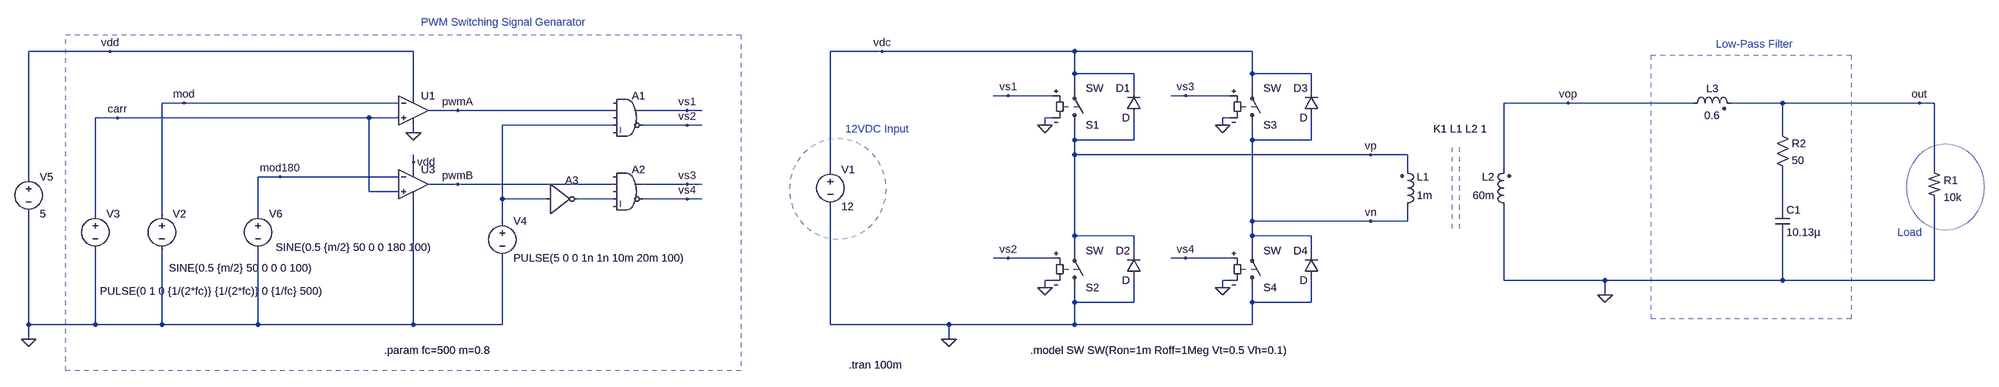
[diagram p0: schematic single-phase-inverter_v2p1.asc]
single-phase-inverter_v2p1.asc, the LTspice schematic file:
Version 4
SHEET 1 2560 1408
WIRE -1952 96 -2128 96
WIRE -1296 96 -1952 96
WIRE -224 96 -336 96
WIRE 192 96 -224 96
WIRE 576 96 192 96
WIRE 192 144 192 96
WIRE 320 144 192 144
WIRE 576 144 576 96
WIRE 704 144 576 144
WIRE 192 176 192 144
WIRE 320 176 320 144
WIRE 576 176 576 144
WIRE 704 176 704 144
WIRE -1296 192 -1296 96
WIRE 48 192 16 192
WIRE 144 192 48 192
WIRE 432 192 400 192
WIRE 528 192 432 192
WIRE -1792 208 -1840 208
WIRE -1328 208 -1792 208
WIRE 1264 208 1120 208
WIRE 1536 208 1264 208
WIRE 1728 208 1616 208
WIRE 2064 208 1728 208
WIRE 2096 208 2064 208
WIRE -1200 224 -1264 224
WIRE -864 224 -1200 224
WIRE -704 224 -800 224
WIRE -672 224 -704 224
WIRE -1936 240 -1984 240
WIRE -1392 240 -1936 240
WIRE -1328 240 -1392 240
WIRE 144 240 128 240
WIRE 528 240 512 240
WIRE -864 256 -1104 256
WIRE -704 256 -800 256
WIRE -672 256 -704 256
WIRE 128 256 128 240
WIRE 512 256 512 240
WIRE -1296 272 -1296 256
WIRE 1728 272 1728 208
WIRE 192 288 192 256
WIRE 320 288 320 240
WIRE 320 288 192 288
WIRE 576 288 576 256
WIRE 704 288 704 240
WIRE 704 288 576 288
WIRE 192 320 192 288
WIRE 832 320 192 320
WIRE 912 320 832 320
WIRE -1296 336 -1296 320
WIRE -1296 352 -1296 336
WIRE -336 352 -336 96
WIRE 912 352 912 320
WIRE 1120 352 1120 208
WIRE 2096 352 2096 208
WIRE -2128 368 -2128 96
WIRE -1584 368 -1632 368
WIRE -1328 368 -1584 368
WIRE -1200 384 -1264 384
WIRE -864 384 -1200 384
WIRE -704 384 -800 384
WIRE -672 384 -704 384
WIRE -1392 400 -1392 240
WIRE -1328 400 -1392 400
WIRE -1104 416 -1104 256
WIRE -1008 416 -1104 416
WIRE -864 416 -944 416
WIRE -704 416 -800 416
WIRE -672 416 -704 416
WIRE 1728 432 1728 352
WIRE -1984 448 -1984 240
WIRE -1840 448 -1840 208
WIRE -1632 448 -1632 368
WIRE -1104 464 -1104 416
WIRE 576 464 576 288
WIRE 832 464 576 464
WIRE 912 464 912 432
WIRE 912 464 832 464
WIRE 192 496 192 320
WIRE 320 496 192 496
WIRE 576 496 576 464
WIRE 704 496 576 496
WIRE 192 528 192 496
WIRE 320 528 320 496
WIRE 576 528 576 496
WIRE 704 528 704 496
WIRE 48 544 16 544
WIRE 144 544 48 544
WIRE 432 544 400 544
WIRE 528 544 432 544
WIRE 144 592 128 592
WIRE 528 592 512 592
WIRE 1120 592 1120 432
WIRE 1344 592 1120 592
WIRE 1728 592 1728 496
WIRE 1728 592 1344 592
WIRE 2096 592 2096 416
WIRE 2096 592 1728 592
WIRE 128 608 128 592
WIRE 512 608 512 592
WIRE 1344 624 1344 592
WIRE 192 640 192 608
WIRE 320 640 320 592
WIRE 320 640 192 640
WIRE 576 640 576 608
WIRE 704 640 704 592
WIRE 704 640 576 640
WIRE -2128 688 -2128 448
WIRE -1984 688 -1984 528
WIRE -1984 688 -2128 688
WIRE -1840 688 -1840 528
WIRE -1840 688 -1984 688
WIRE -1632 688 -1632 528
WIRE -1632 688 -1840 688
WIRE -1296 688 -1296 416
WIRE -1296 688 -1632 688
WIRE -1104 688 -1104 544
WIRE -1104 688 -1296 688
WIRE -336 688 -336 432
WIRE -80 688 -336 688
WIRE 192 688 192 640
WIRE 192 688 -80 688
WIRE 576 688 576 640
WIRE 576 688 192 688
WIRE -2128 720 -2128 688
WIRE -80 720 -80 688
FLAG 512 256 0
FLAG 512 608 0
FLAG 128 608 0
FLAG 128 256 0
FLAG 48 192 vs1
FLAG 48 544 vs2
FLAG 432 192 vs3
FLAG 432 544 vs4
FLAG -80 720 0
FLAG 832 320 vp
FLAG 832 464 vn
FLAG 1264 208 vop
FLAG 1344 624 0
FLAG -224 96 vdc
FLAG 2064 208 out
FLAG -1200 224 pwmA
FLAG -704 224 vs1
FLAG -704 384 vs3
FLAG -2128 720 0
FLAG -1200 384 pwmB
FLAG -1936 240 carr
FLAG -1792 208 mod
FLAG -1296 272 0
FLAG -704 256 vs2
FLAG -704 416 vs4
FLAG -1296 336 vdd
FLAG -1952 96 vdd
FLAG -1584 368 mod180
SYMBOL sw 192 272 M180
SYMATTR InstName S1
SYMBOL sw 192 624 M180
SYMATTR InstName S2
SYMBOL sw 576 272 M180
SYMATTR InstName S3
SYMBOL sw 576 624 M180
SYMATTR InstName S4
SYMBOL voltage -336 336 R0
SYMATTR InstName V1
SYMATTR Value 12
SYMBOL ind2 896 448 M180
WINDOW 0 36 80 Left 2
WINDOW 3 36 40 Left 2
SYMATTR InstName L1
SYMATTR Value 1m
SYMBOL ind2 1136 448 R180
WINDOW 0 36 80 Left 2
WINDOW 3 36 40 Left 2
SYMATTR InstName L2
SYMATTR Value 60m
SYMBOL res2 2080 352 R0
SYMATTR InstName R1
SYMATTR Value 10k
SYMBOL ind2 1520 224 R270
WINDOW 0 32 56 VTop 2
WINDOW 3 5 56 VBottom 2
SYMATTR InstName L3
SYMATTR Value 0.6
SYMATTR SpiceLine Rser=1m
SYMATTR Type ind
SYMBOL cap 1712 432 R0
SYMATTR InstName C1
SYMATTR Value 10.13µ
SYMBOL inv -1008 352 R0
SYMATTR InstName A3
SYMATTR SpiceLine VHIGH=5
SYMBOL voltage -1840 432 R0
WINDOW 3 15 134 Left 2
SYMATTR Value SINE(0.5 {m/2} 50 0 0 0 100)
SYMATTR InstName V2
SYMBOL voltage -1984 432 R0
WINDOW 3 10 184 Left 2
SYMATTR Value PULSE(0 1 0 {1/(2*fc)} {1/(2*fc)} 0 {1/fc} 500)
SYMATTR InstName V3
SYMBOL voltage -1104 448 R0
SYMATTR InstName V4
SYMATTR Value PULSE(5 0 0 1n 1n 10m 20m 100)
SYMBOL OpAmps/UniversalOpAmp2 -1296 224 R0
SYMATTR InstName U1
SYMATTR SpiceLine Ilimit=25m Rail=1 Vos=0
SYMBOL Digital/and -832 176 R0
SYMATTR InstName A1
SYMATTR SpiceLine VHIGH=5
SYMBOL Digital/and -832 336 R0
SYMATTR InstName A2
SYMATTR SpiceLine VHIGH=5
SYMBOL voltage -2128 352 R0
SYMATTR InstName V5
SYMATTR Value 5
SYMATTR SpiceLine Rser=1m
SYMBOL diode 336 240 R180
WINDOW 0 24 64 Left 2
WINDOW 3 24 0 Left 2
SYMATTR InstName D1
SYMBOL diode 336 592 R180
WINDOW 0 24 64 Left 2
WINDOW 3 24 0 Left 2
SYMATTR InstName D2
SYMBOL diode 720 240 R180
WINDOW 0 24 64 Left 2
WINDOW 3 24 0 Left 2
SYMATTR InstName D3
SYMBOL diode 720 592 R180
WINDOW 0 24 64 Left 2
WINDOW 3 24 0 Left 2
SYMATTR InstName D4
SYMBOL OpAmps/UniversalOpAmp2 -1296 384 R0
SYMATTR InstName U3
SYMATTR SpiceLine Ilimit=25m Rail=1 Vos=0
SYMBOL voltage -1632 432 R0
WINDOW 3 38 89 Left 2
SYMATTR Value SINE(0.5 {m/2} 50 0 0 180 100)
SYMATTR InstName V6
SYMBOL Res 1712 256 R0
SYMATTR InstName R2
SYMATTR Value 50
TEXT 96 744 Left 2 !.model SW SW(Ron=1m Roff=1Meg Vt=0.5 Vh=0.1)
TEXT -1360 744 Left 2 !.param fc=500 m=0.8
TEXT -1280 32 Left 2 ;PWM Switching Signal Genarator
TEXT -304 264 Left 2 ;12VDC Input
TEXT 968 264 Left 2 !K1 L1 L2 1
TEXT -296 776 Left 2 !.tran 100m
TEXT 1584 80 Left 2 ;Low-Pass Filter
TEXT 2016 488 Left 2 ;Load
LINE Normal 1008 304 1008 480 2
LINE Normal 1024 304 1024 480 2
RECTANGLE Normal -2048 60 -588 788 3
RECTANGLE Normal 1444 104 1876 676 3
CIRCLE Normal -424 284 -216 504 3
CIRCLE Normal 2036 296 2204 484 3

The netlist it stands for:
* single-phase-inverter_v2p1.asc
S1 vp vdc vs1 0 SW
S2 0 vp vs2 0 SW
S3 vn vdc vs3 0 SW
S4 0 vn vs4 0 SW
V1 vdc 0 12
L1 vn vp 1m
L2 0 vop 60m
R1 out 0 10k
L3 vop out 0.6 Rser=1m
C1 N003 0 10.13µ
A3 N001 0 0 0 0 N002 0 0 BUF VHIGH=5
V2 mod 0 SINE(0.5 {m/2} 50 0 0 0 100)
V3 carr 0 PULSE(0 1 0 {1/(2*fc)} {1/(2*fc)} 0 {1/fc} 500)
V4 N001 0 PULSE(5 0 0 1n 1n 10m 20m 100)
XU1 carr mod vdd 0 pwmA level2 Avol=1Meg GBW=10Meg Slew=10Meg Ilimit=25m Rail=1 Vos=0 En=0 Enk=0 In=0 Ink=0 Rin=500Meg  ; pins In+ In- V+ V- OUT
A1 0 pwmA 0 N001 0 vs2 vs1 0 AND VHIGH=5
A2 0 pwmB 0 N002 0 vs4 vs3 0 AND VHIGH=5
V5 vdd 0 5 Rser=1m
D1 vp vdc D
D2 0 vp D
D3 vn vdc D
D4 0 vn D
XU3 carr mod180 vdd 0 pwmB level2 Avol=1Meg GBW=10Meg Slew=10Meg Ilimit=25m Rail=1 Vos=0 En=0 Enk=0 In=0 Ink=0 Rin=500Meg  ; pins In+ In- V+ V- OUT
V6 mod180 0 SINE(0.5 {m/2} 50 0 0 180 100)
R2 out N003 50
.model D D
.lib standard.dio
.model SW SW(Ron=1m Roff=1Meg Vt=0.5 Vh=0.1)
.param fc=500 m=0.8
* PWM Switching Signal Genarator
* 12VDC Input
K1 L1 L2 1
.tran 100m
* Low-Pass Filter
* Load
.lib UniversalOpAmp2.lib
.backanno
.end